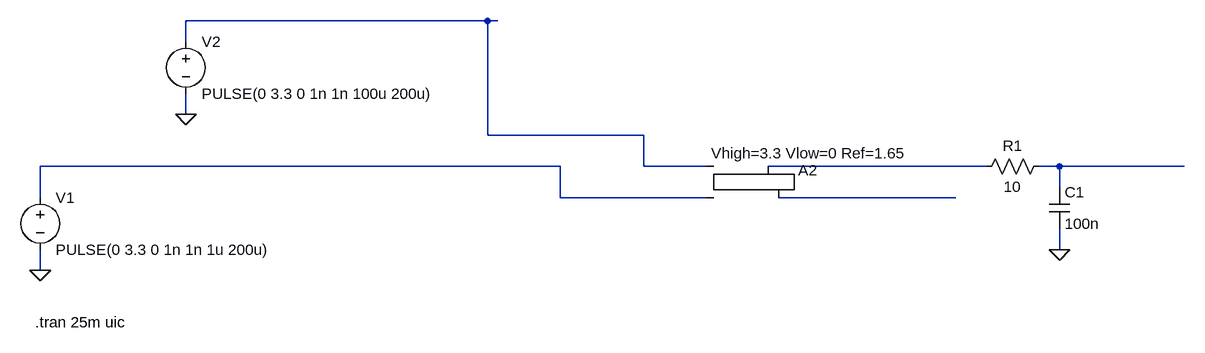
[diagram p0: schematic Logic.asc]
Logic.asc, the LTspice schematic file:
Version 4.1
SHEET 1 1636 680
WIRE 560 -192 96 -192
WIRE 576 -192 560 -192
WIRE 96 -160 96 -192
WIRE 96 -48 96 -80
WIRE 560 -16 560 -192
WIRE 800 -16 560 -16
WIRE 672 32 -128 32
WIRE 800 32 800 -16
WIRE 896 32 800 32
WIRE 1328 32 992 32
WIRE 1440 32 1408 32
WIRE 1632 32 1440 32
WIRE 1440 64 1440 32
WIRE -128 80 -128 32
WIRE 672 80 672 32
WIRE 896 80 672 80
WIRE 1280 80 1008 80
WIRE 1440 160 1440 128
WIRE -128 192 -128 160
FLAG -128 192 0
FLAG 96 -48 0
FLAG 1440 160 0
SYMBOL voltage -128 64 R0
WINDOW 123 0 0 Left 0
WINDOW 39 0 0 Left 0
SYMATTR InstName V1
SYMATTR Value PULSE(0 3.3 0 1n 1n 1u 200u)
SYMBOL voltage 96 -176 R0
WINDOW 123 0 0 Left 0
WINDOW 39 0 0 Left 0
SYMATTR InstName V2
SYMATTR Value PULSE(0 3.3 0 1n 1n 100u 200u)
SYMBOL Digital\\srflop 944 -16 R0
WINDOW 3 -40 28 Left 2
SYMATTR InstName A2
SYMATTR Value Vhigh=3.3 Vlow=0 Ref=1.65
SYMBOL res 1424 16 R90
WINDOW 0 0 56 VBottom 2
WINDOW 3 32 56 VTop 2
SYMATTR InstName R1
SYMATTR Value 10
SYMBOL cap 1424 64 R0
SYMATTR InstName C1
SYMATTR Value 100n
TEXT -136 272 Left 2 !.tran 25m uic

The netlist it stands for:
* Logic.asc
V1 N002 0 PULSE(0 3.3 0 1n 1n 1u 200u)
V2 N001 0 PULSE(0 3.3 0 1n 1n 100u 200u)
A2 N001 N002 0 0 0 N005 N003 0 SRFLOP Vhigh=3.3 Vlow=0 Ref=1.65
R1 N004 N003 10
C1 N004 0 100n
.tran 25m uic
.backanno
.end